# Altium schematic sheet PAJ7620U2_Interface.SchDoc: PAJ7620U2_Interface
size A4
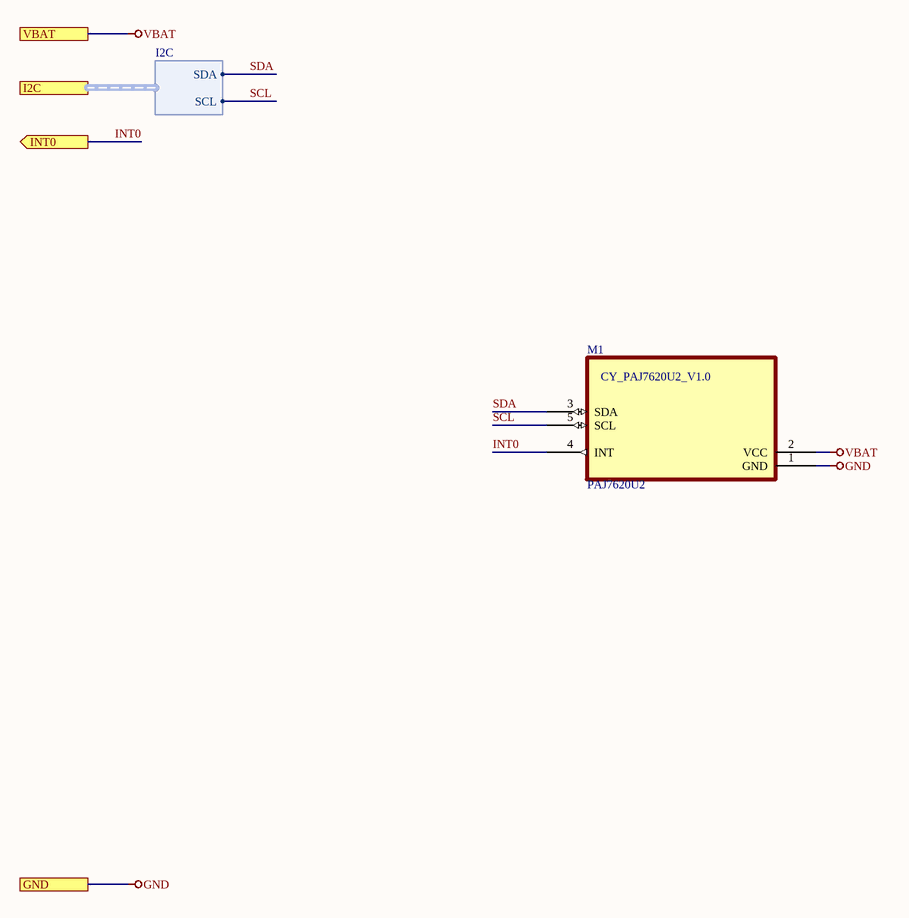
[diagram p0: PAJ7620U2_Interface.SchDoc]

## Parts
M1  PAJ7620U2  [PAJ7620U2_Interface]

## Ports
GND, I2C (harness I2C), INT0 (out), VBAT

## Harnesses
I2C: SDA, SCL

## Nets
GND: M1.1(GND) ; port GND
VBAT: M1.2(VCC) ; port VBAT
INT0: M1.4(INT) ; port INT0
SCL: M1.5(SCL) ; port I2C.SCL
SDA: M1.3(SDA) ; port I2C.SDA

## Notes on the sheet
- (in symbol PAJ7620U2_Interface) CY_PAJ7620U2_V1.0

## Library data of the parts
M1 = PAJ7620U2_Interface